# Altium schematic sheet ESP_3_ERC.SchDoc
size A3; SheetNumber: 1; SheetTotal: 1
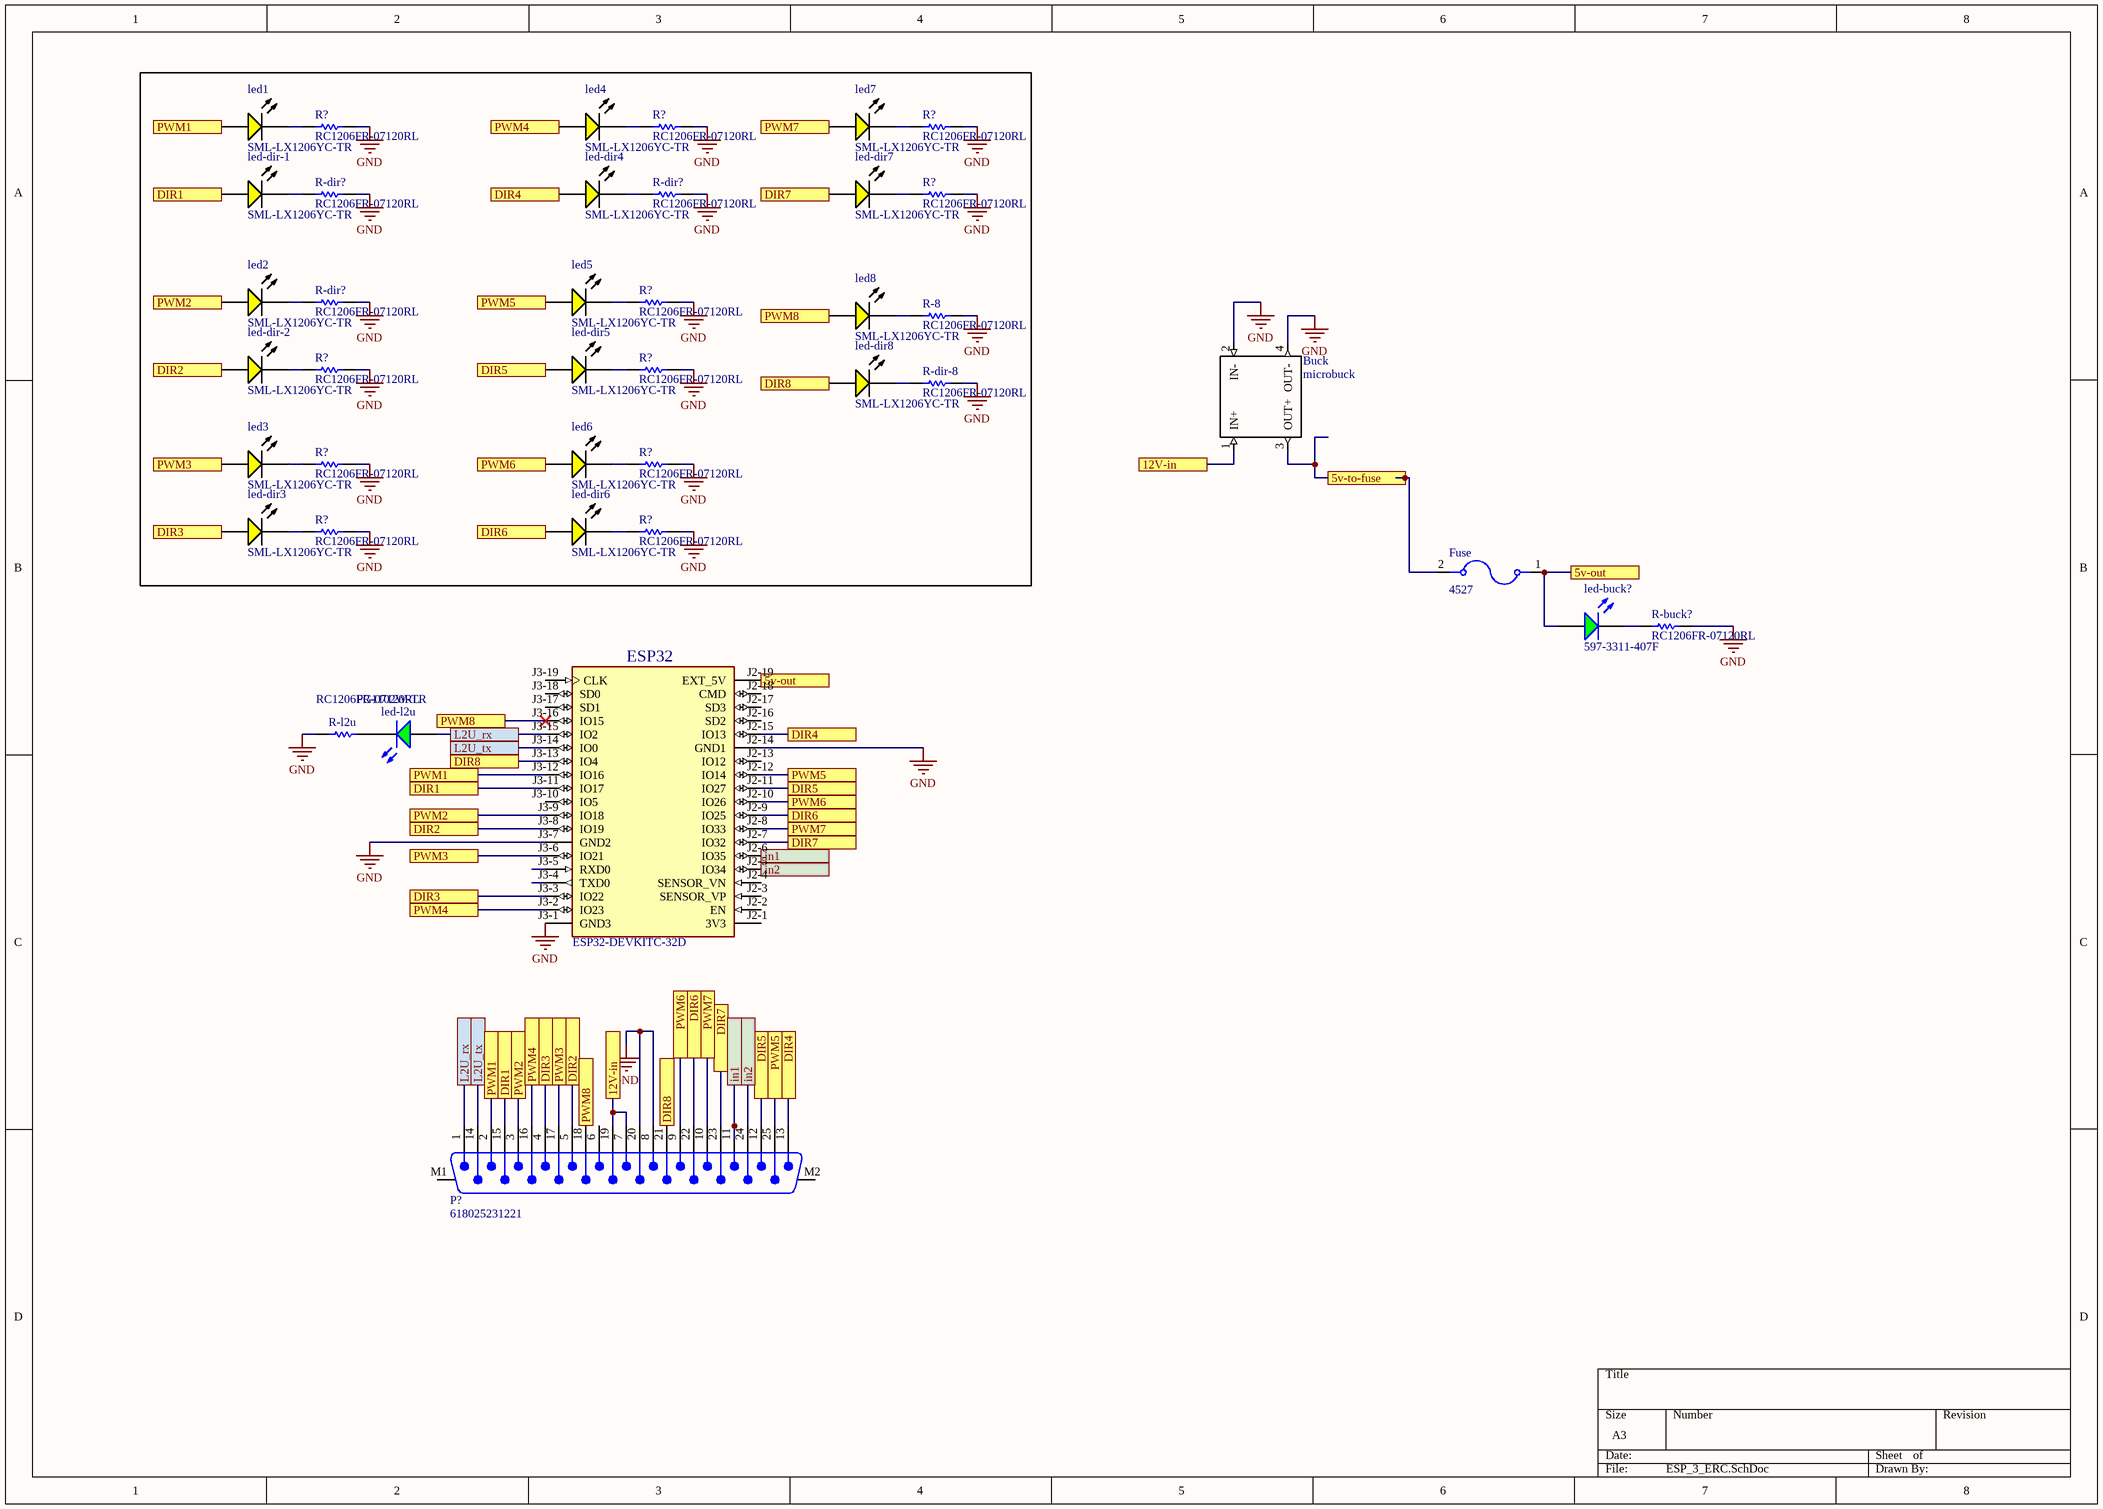
[diagram p0: ESP_3_ERC.SchDoc]

## Parts
(Parts that share a designator on the sheet are numbered #1, #2 ... from top to bottom, then left to right.)
Buck  microbuck  [Micro buck]
ESP32  ESP32-DEVKITC-32D  [MODULE_ESP32-DEVKITC-32D]
Fuse  4527  [FUSE_4527]
led1  SML-LX1206YC-TR  [LUMX-SML-LX1206YC-TR_V]
led2  SML-LX1206YC-TR  [LUMX-SML-LX1206YC-TR_V]
led3  SML-LX1206YC-TR  [LUMX-SML-LX1206YC-TR_V]
led4  SML-LX1206YC-TR  [LUMX-SML-LX1206YC-TR_V]
led5  SML-LX1206YC-TR  [LUMX-SML-LX1206YC-TR_V]
led6  SML-LX1206YC-TR  [LUMX-SML-LX1206YC-TR_V]
led7  SML-LX1206YC-TR  [LUMX-SML-LX1206YC-TR_V]
led8  SML-LX1206YC-TR  [LUMX-SML-LX1206YC-TR_V]
led-buck?  597-3311-407F  [DIAL-597-3311-407F_V]
led-dir3  SML-LX1206YC-TR  [LUMX-SML-LX1206YC-TR_V]
led-dir4  SML-LX1206YC-TR  [LUMX-SML-LX1206YC-TR_V]
led-dir5  SML-LX1206YC-TR  [LUMX-SML-LX1206YC-TR_V]
led-dir6  SML-LX1206YC-TR  [LUMX-SML-LX1206YC-TR_V]
led-dir7  SML-LX1206YC-TR  [LUMX-SML-LX1206YC-TR_V]
led-dir8  SML-LX1206YC-TR  [LUMX-SML-LX1206YC-TR_V]
led-dir-1  SML-LX1206YC-TR  [LUMX-SML-LX1206YC-TR_V]
led-dir-2  SML-LX1206YC-TR  [LUMX-SML-LX1206YC-TR_V]
led-l2u  PG1102W-TR  [STEC-1102W_V]
P?  618025231221  [618025231221]
R-8  RC1206FR-07120RL  [RESC3116X65X40LL10T20]
R-buck?  RC1206FR-07120RL  [RESC3116X65X40LL10T20]
R-dir-8  RC1206FR-07120RL  [RESC3116X65X40LL10T20]
R-dir?#1  RC1206FR-07120RL  [RESC3116X65X40LL10T20]
R-dir?#2  RC1206FR-07120RL  [RESC3116X65X40LL10T20]
R-dir?#3  RC1206FR-07120RL  [RESC3116X65X40LL10T20]
R-l2u  RC1206FR-07120RL  [RESC3116X65X40LL10T20]
R?#1  RC1206FR-07120RL  [RESC3116X65X40LL10T20]
R?#2  RC1206FR-07120RL  [RESC3116X65X40LL10T20]
R?#3  RC1206FR-07120RL  [RESC3116X65X40LL10T20]
R?#4  RC1206FR-07120RL  [RESC3116X65X40LL10T20]
R?#5  RC1206FR-07120RL  [RESC3116X65X40LL10T20]
R?#6  RC1206FR-07120RL  [RESC3116X65X40LL10T20]
R?#7  RC1206FR-07120RL  [RESC3116X65X40LL10T20]
R?#8  RC1206FR-07120RL  [RESC3116X65X40LL10T20]
R?#9  RC1206FR-07120RL  [RESC3116X65X40LL10T20]
R?#10  RC1206FR-07120RL  [RESC3116X65X40LL10T20]
R?#11  RC1206FR-07120RL  [RESC3116X65X40LL10T20]

## Ports
5v-out, 5v-to-fuse, 12V-in, DIR1, DIR2, DIR3, DIR4, DIR5, DIR6, DIR7, DIR8, in1, in2, L2U_rx, L2U_tx, PWM1, PWM2, PWM3, PWM4, PWM5, PWM6, PWM7, PWM8

## Nets
GND: Buck.2(IN-) Buck.4(OUT-) ESP32.J2-14(GND1) ESP32.J3-1(GND3) ESP32.J3-7(GND2) P?.8 P?.20 R-8.2 R-buck?.2 R-dir-8.2 R-dir?#1.2 R-dir?#2.2 R-dir?#3.2 R-l2u.1 R?#1.2 R?#2.2 R?#3.2 R?#4.2 R?#5.2 R?#6.2 R?#7.2 R?#8.2 R?#9.2 R?#10.2 R?#11.2
5v-out: ESP32.J2-19(EXT_5V) Fuse.1 led-buck?.1(A) ; port 5v-out
5v-to-fuse: Buck.3(OUT+) Fuse.2 ; port 5v-to-fuse
12V-in: Buck.1(IN+) P?.7 P?.19 ; port 12V-in
DIR1: ESP32.J3-11(IO17) led-dir-1.1(A) P?.15 ; port DIR1
DIR2: ESP32.J3-8(IO19) led-dir-2.1(A) P?.5 ; port DIR2
DIR3: ESP32.J3-3(IO22) led-dir3.1(A) P?.4 ; port DIR3
DIR4: ESP32.J2-15(IO13) led-dir4.1(A) P?.13 ; port DIR4
DIR5: ESP32.J2-11(IO27) led-dir5.1(A) P?.12 ; port DIR5
DIR6: ESP32.J2-9(IO25) led-dir6.1(A) P?.22 ; port DIR6
DIR7: ESP32.J2-7(IO32) led-dir7.1(A) P?.23 ; port DIR7
DIR8: ESP32.J3-13(IO4) led-dir8.1(A) P?.21 ; port DIR8
in1: ESP32.J2-6(IO35) P?.11 ; port in1
in2: ESP32.J2-5(IO34) P?.24 ; port in2
L2U_rx: ESP32.J3-15(IO2) led-l2u.1(A) P?.1 ; port L2U_rx
L2U_tx: ESP32.J3-14(IO0) P?.14 ; port L2U_tx
PWM1: ESP32.J3-12(IO16) led1.1(A) P?.2 ; port PWM1
PWM2: ESP32.J3-9(IO18) led2.1(A) P?.3 ; port PWM2
PWM3: ESP32.J3-6(IO21) led3.1(A) P?.17 ; port PWM3
PWM4: ESP32.J3-2(IO23) led4.1(A) P?.16 ; port PWM4
PWM5: ESP32.J2-12(IO14) led5.1(A) P?.25 ; port PWM5
PWM6: ESP32.J2-10(IO26) led6.1(A) P?.9 ; port PWM6
PWM7: ESP32.J2-8(IO33) led7.1(A) P?.10 ; port PWM7
PWM8: ESP32.J3-16(IO15) led8.1(A) P?.18 ; port PWM8
Netled1_2: led1.2(K) R?#1.1
Netled2_2: led2.2(K) R-dir?#3.1
Netled3_2: led3.2(K) R?#8.1
Netled4_2: led4.2(K) R?#2.1
Netled5_2: led5.2(K) R?#5.1
Netled6_2: led6.2(K) R?#9.1
Netled7_2: led7.2(K) R?#3.1
Netled8_2: led8.2(K) R-8.1
Netled-buck?_2: led-buck?.2(K) R-buck?.1
Netled-dir3_2: led-dir3.2(K) R?#10.1
Netled-dir4_2: led-dir4.2(K) R-dir?#2.1
Netled-dir5_2: led-dir5.2(K) R?#7.1
Netled-dir6_2: led-dir6.2(K) R?#11.1
Netled-dir7_2: led-dir7.2(K) R?#4.1
Netled-dir8_2: led-dir8.2(K) R-dir-8.1
Netled-dir-1_2: led-dir-1.2(K) R-dir?#1.1
Netled-dir-2_2: led-dir-2.2(K) R?#6.1
Netled-l2u_2: led-l2u.2(K) R-l2u.2

Not connected (* = marked no-connect by the designer): ESP32 J2-1(3V3) J2-2(EN) J2-3(SENSOR_VP) J2-4(SENSOR_VN) J2-13(IO12) J2-16(SD2) J2-17(SD3) J2-18(CMD) J3-4(TXD0) J3-5(RXD0) J3-10(IO5) J3-17(SD1) J3-18(SD0) J3-19(CLK); P? 6 M1 M2

## Library data of the parts
ESP32 = ESP32-DEVKITC-32D: WiFi Development Tools (802.11) ESP32 General Development Kit, ESP32-WROOM-32D on the board; MF: Espressif Systems; SnapEDA_Link: https://www.snapeda.com/parts/ESP32-DEVKITC-32D/Espressif+Systems/view-part/?ref=snap; Package: None; Value: *; MP: ESP32-DEVKITC-32D; Check_prices: https://www.snapeda.com/parts/ESP32-DEVKITC-32D/Espressif+Systems/view-part/?ref=eda
Fuse = 4527: Fuseholder; 5 A; 250 V; Nylon; Base only; Brass, Tin Plate (Contact); Value: *; MP: 4527; Package: None; Availability: Unavailable; Price: None
led1-led8 led-dir3-led-dir8 led-dir-1 led-dir-2 = CMP-2000-07124-1: Yellow LED, Water Clear Len, 585 nm, 2.1 V, -40 to 85 degC, 2-Pin SMD, RoHS, Tape and Reel; Manufacturer: Lumex; Product Training Modules: LEDsBenefitsofCustomLEDandLCDTechnology; Millicandela Rating: 6mcd; Catalog Drawings: SML-LX1206SeriesTopSML-LX1206SeriesSideSML-LX1206SeriesBottomSML-LX1206SeriesFootprint; Wavelength - Peak: 585nm; Other Names: 67-1358-2LU60357TRSMLLX1206YCTR; Lens Style/Size: RectanglewithFlatTop; Current - Test: 20mA; Lens Color: Colorless; Viewing Angle: 160°; Voltage - Forward (Vf) (Typ): 2.1V; Online Catalog: SML-LX1206RectanglewithFlatTop1206PackageLEDs; Mounting Type: SurfaceMount; Package Description: 2-Pin Surface Mount Device, Body 3.2 x 1.5 mm; Datasheet Version: Rev. K, 08/2012; Features: -; Color: Yellow; RoHS Information: RoHSCertofCompliance; Package Reference: SML-LX1206YC-TR; Supplier Device Package: 1206; Standard Package: 3,000; Series: -; Wavelength - Dominant: -; Package / Case: 1206(3216Metric); Mounting Technology: SurfaceMount; Height (Max): 1.10mm; Lens Transparency: Clear; Datasheet URL: http://www.lumex.com/content/files/ProductAttachment/SML-LX1206YC-TR.pdf; Family: LEDIndication-Discrete; Manufacturer URL: http://www.lumexinstruments.com/; Packaging: Tape&Reel(TR); Category: Optoelectronics; Size / Dimension: 3.20mmLx1.60mmW
led-buck? = CMP-2000-05651-1: LED Green, 75 mW, 30 mA, -30 to 85 degC, 2-Pin SMD, RoHS, Tape and Reel; Manufacturer: Dialight; Product Depth (mm): 1.5mm; Viewing Angle: 70deg; DELETED: Compliant; Number of  Elements: 1; Emitting Color: YellowGreen; Shape Type: Rectangular; Product Length (mm): 3mm; Forward Current: 30mA; Main Category: ChipLED; Luminous Intensity: 7.5mcd; High Brightness: No; Test Current (It): 20mA; Lens Type: NonDiffused; Reverse Voltage: 4V; Peak Wavelength: 560nm; Power Dissipation: 75W; Forward Voltage: 2.5V; Chip Material: GaP; Mounting: SurfaceMount; Product Height (mm): 1.5mm; Pin Count: 2; Type: Uni-Color; Datasheet URL: https://datasheet.ciiva.com/15117/getdatasheetpartid-142484-15117764.pdf; Mounting Technology: SurfaceMount; Rad Hardened: No; Operating Temperature Classification: Commercial; Lens Dimensions: 2x1.5x0.9mm; Operating Temp Range: -30Cto85C; Package Reference: 597-3311-407F; Package Type: SMD; Datasheet Version: 07/2002; Lum Intensity: 7.5mcd; Packaging: TapeandReel; Package Description: 2-Pin Surface Mount Device, Body 1.5 x 3 mm; Manufacturer URL: http://www.dialight.com/
led-l2u = CMP-2000-06890-1: Green LED, 567 nm, 2.1 V, 30 mA, -30 to 85 degC, 2-Pin SMD, RoHS, Tape and Reel; Manufacturer: Stanley Electric; Viewing Angle: 69/85deg; High Brightness: No; Number of  Elements: 1; Peak Wavelength: 560nm; Forward Current: 30mA; Test Current (It): 20mA; Main Category: ChipLED; Dominant Wave Length: 567nm; Power Dissipation: 75W; Lum Intensity: 12mcd; Shape Type: Rectangular; Chip Material: GaP; Reverse Voltage: 4V; Product Depth (mm): 1.5mm; Forward Voltage: 2.5V; Product Length (mm): 3mm; DELETED: Compliant; Emitting Color: YellowGreen; Operating Temp Range: -30Cto85C; Datasheet URL: http://media.digikey.com/pdf/Data%20Sheets/Stanley%20Electric%20PDFs/1102W_Series.pdf; Packaging: TapeandReel; Package Reference: 1102W; Manufacturer URL: http://www.stanley-electric.com/; Package Description: 2-Pin Surface Mounted Device , Body 3 x 1.5 mm; Type: Uni-Color; Rad Hardened: No; Mounting Technology: SurfaceMount; Package Type: SMD; Operating Temperature Classification: Commercial; Product Height (mm): 1.5mm; Pin Count: 2; Lens Dimensions: 2x1.5x0.9mm; Datasheet Version: 08/2007; Mounting: SurfaceMount; Luminous Intensity: 12mcd
P? = CMP-1502-00286-2: NexarPartId: 18818208; Operating Supply Voltage: 125V; Number of Contacts: 25; Current Rating: 3A; Insulation Resistance: 5GΩ; Gender: Male; Pitch: 2.77mm; Contact Resistance: 30mΩ; Mount: Through Hole; REACH SVHC: Unknown; Depth: 18.5mm; Orientation: Right Angle; Length: 53.1mm; RoHS: Compliant; Contact Plating: Gold; Insulation Material: PBT; Termination: SMD/SMT; Min Operating Temperature: -55°C; Voltage Rating: 125V; Number of Pins: 25; Housing Material: Steel; Max Operating Temperature: 105°C; Number of Rows: 2; Width: 12.5mm
R-8 R-buck? R-dir-8 R-dir?#1-R-dir?#3 R-l2u R?#1-R?#11 = CMP-2000-06965-1: Chip Resistor, 120 Ohm, +/- 1%, 250 mW, -55 to 155 degC, 1206 (3216 Metric), RoHS, Tape and Reel; Manufacturer: Yageo; Resistor Element Type: ThickFilm; Resistance: 120ohm; Voltage Rating: 200V; Temperature Coefficient: ±100ppm/°C; Power Rating: 250mW; Product Range: RCSeries; SVHC: ToBeAdvised; Resistor Case Style: 1206[3216Metric]; Package Reference: 1206; Resistance Tolerance: ±1%; Package Description: 2-Pin Surface Mount Device, Body 3.1 x 1.6 mm; Manufacturer URL: http://www.yageo.com/; MSL: MSL1-Unlimited; Packaging: CutTape; Datasheet URL: http://www.yageo.com/documents/recent/PYu-RC_Group_51_RoHS_L_7.pdf; Mounting Technology: SurfaceMount; Datasheet Version: Rev. 7, 05/2017